# EAGLE design ExternalLEDsSUPERSMALL (EAGLE 8.3.2)
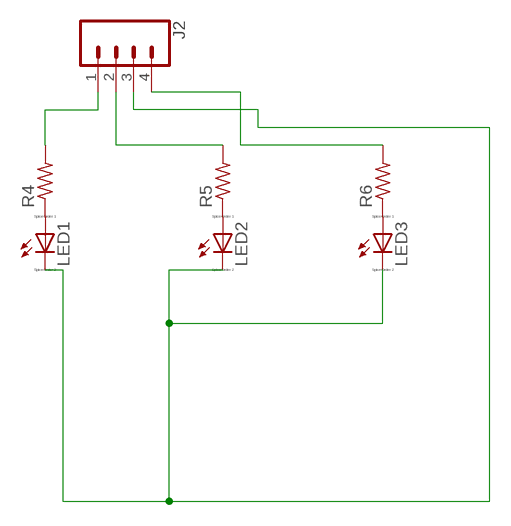
[diagram p0: schematic, sheet 1]

## Parts
J2  CONN_04POLAR  [MOLEX-1X4]
LED1  LED_E  [LED_1206]
LED2  LED_E  [LED_1206]
LED3  LED_E  [LED_1206]
R4  R-US_M1206  [M1206]
R5  R-US_M1206  [M1206]
R6  R-US_M1206  [M1206]

## Nets
N$1: J2.1 R4.2
N$2: J2.2 R5.2
N$3: J2.4 R6.2
N$4: LED1.A R4.1
N$5: LED2.A R5.1
N$6: LED3.A R6.1
N$7: J2.3 LED1.C LED2.C LED3.C

## Library data of the parts
J2 = SparkFun-Connectors:CONN_04: Multi connection point. Often used as Generic Header-pin footprint for 0.1 inch spaced/style header connections On any of the 0.1 inch spaced packages, you can populate with these: Break Away Headers - Straight <https://www.sparkfun.com/products/116> (PRT-00116) Break Away Male Headers - Right Angle <https://www.sparkfun.com/products/553> (PRT-00553) Female Headers <https://www.sparkfun.com/products/115> (PRT-00115) Break Away Headers - Machine Pin <https://www.sparkfun.com/products/117> (PRT-00117) Break Away Female Headers - Swiss Machine Pin <https://www.sparkfun.com/products/743> (PRT-00743) For SCREWTERMINALS and SPRING TERMINALS visit here: Screw Terimnals on SparkFun.com <https://www.sparkfun.com/search/results?term=Screw+Terminals> (5mm/3.5mm/2.54mm spacing) This device is also useful as a general connection point to wire up your design to another part of your project. Our various solder wires solder well into these plated through hole pads. Hook-Up Wire - Assortment (Stranded, 22 AWG) <https://www.sparkfun.com/products/11375> (PRT-11375) Hook-Up Wire - Assortment (Solid Core, 22 AWG) <https://www.sparkfun.com/products/11367> (PRT-11367) View the entire wire category on our website here <https://www.sparkfun.com/categories/141> Special notes: Molex polarized connector foot print use with SKU : PRT-08231 with associated crimp pins and housings. 1MM SMD Version SKU: PRT-10208; PROD_ID: CONN-08186; SF_ID: PRT-08231
LED1-LED3 = eagle-ltspice:LED_E: LED Source: http://www.osram.convergy.de Source: www.luxeon.com Source: www.kingbright.com; SPICEMODEL: NONE; SPICEPREFIX: D; SPICETYPE: diode
R4-R6 = resistor:R-US_: RESISTOR, American symbol

## Board
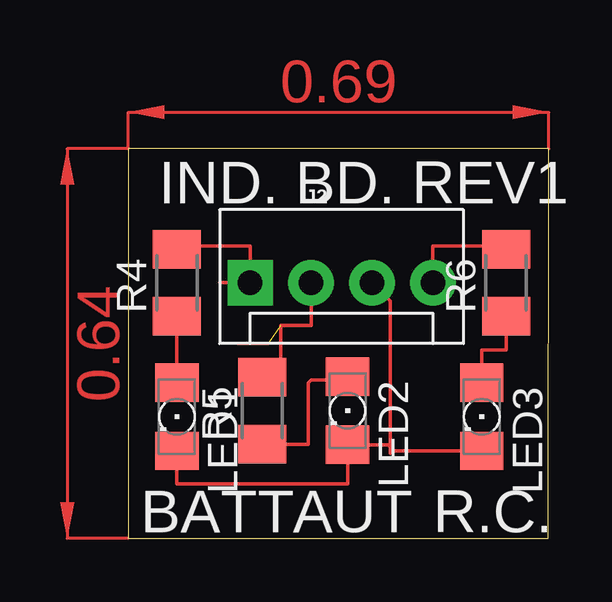
[diagram p1: board, top side]

Size 17.53 x 16.26 mm. Coordinates in mm from the lower left corner, seen from the top.
Outline: 0,0 17.51,0 17.53,16.26 0,16.26 0,0
Copper layers (1*16): Top 0.035mm / dielectric 1.5mm / Bottom 0.035mm
Design rules "default": minimum track width 6mil, minimum drill 0.35mm, track to track 6mil, track to pad 6mil, pad to pad 6mil, via to via 6mil, smd to smd 6mil, copper to edge 40mil, drill to drill 6mil, minimum pad ring 10mil, minimum via ring 8mil, stop-mask expansion 4mil, vias tented up to drill 0mil, thermal gap 10mil

### Footprints (pad centres in the part's own frame; a part is rotated, then mirrored left to right if it is on the bottom)
MOLEX-1X4 = drill 1.016 pad 1.88 square: 1 0,0 | drill 1.016 pad 1.88: 2 2.54,0; 3 5.08,0; 4 7.62,0
LED_1206 = smd 1.6 x 1.803: A -1.422,0; C 1.422,0
M1206 = smd 1.6 x 2: 1 -1.4,0; 2 1.4,0

### Placement (x,y rotation side)
J2  5.08,10.67 0 top
LED1  2.03,5.08 270 top
LED2  9.14,5.33 270 top
LED3  14.73,5.08 270 top
R4  2.03,10.67 90 top
R5  5.59,5.33 90 top
R6  15.75,10.67 90 top

### Tracks (layer width: path | path; a pad name or v marks a point on that pad's centre or on a via)
N$1
  Top 0.152: 3.81,10.67 J2.1 5.08,12.19 2.16,12.19 R4.2
N$2  (1 unrouted)
  Top 0.152: 5.84,8.13 4.57,8.13 | J2.2 7.62,8.89 6.35,8.89 6.35,6.99 R5.2
N$3
  Top 0.152: J2.4 12.7,12.19 15.62,12.19 R6.2
N$4
  Top 0.152: R4.1 LED1.A
N$5
  Top 0.152: R5.1 7.5,3.93 7.5,6.48 7.62,6.6 8.99,6.6 LED2.A
N$6
  Top 0.152: LED3.A 14.73,7.87 15.75,7.87 R6.1
N$7
  Top 0.152: LED1.C 2.03,2.29 9.14,2.29 LED2.C 10.82,3.91 10.92,3.81 | LED3.C 11.02,3.66 10.92,3.56 10.92,3.81 | 10.92,3.81 10.92,9.91 J2.3
(copper drawn outside any net)
  shapes: Top area x2

### Text on the board
tPlace: IND. BD. REV1 | BATT | AUT | R.C.